# EAGLE design Tsop Receiver (EAGLE 7.6.0)
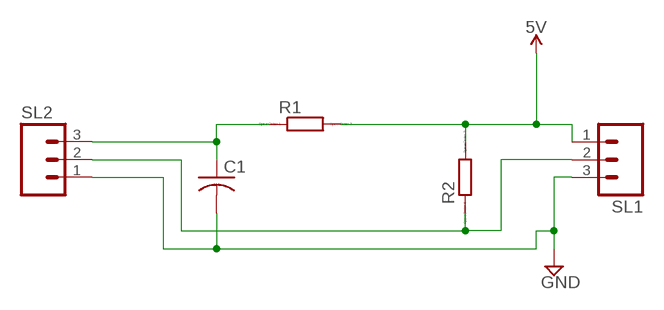
[diagram p0: schematic, sheet 1]

## Parts
C1  C-US025-024X044  [C025-024X044]
R1  R0207/10  [0207/10]
R2  R0207/10  [0207/10]
SL1  M03  [03P]
SL2  M03  [03P]

## Nets
5V: R1.2 R2.2 SL1.1
GND: C1.2 SL1.3 SL2.1
N$1: C1.1 R1.1 SL2.3
N$3: R2.1 SL1.2 SL2.2

## Library data of the parts
C1 = rcl:C-US: CAPACITOR, American symbol
R1 R2 = eagle-ltspice:R: RESISTOR, European symbol; SPICEMODEL: NONE; SPICEPREFIX: R
SL1 SL2 = con-amp-quick:M03: AMP QUICK CONNECTOR; OC_FARNELL: unknown; OC_NEWARK: unknown

## Board
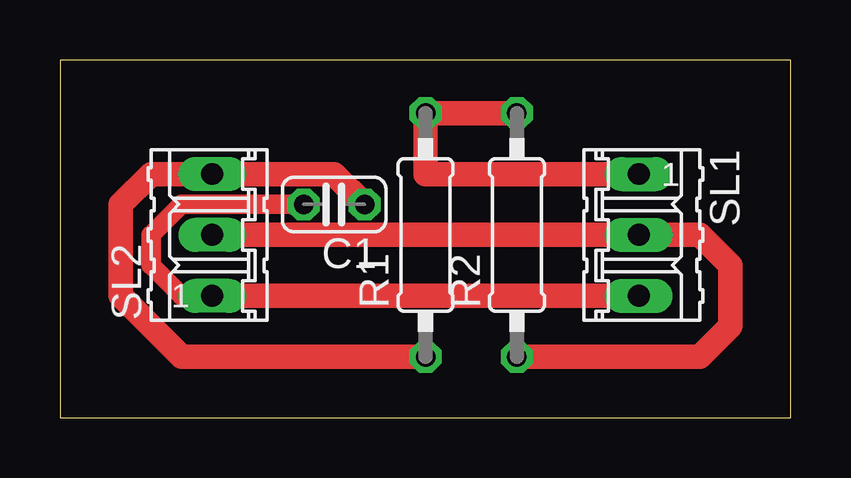
[diagram p1: board, top side]
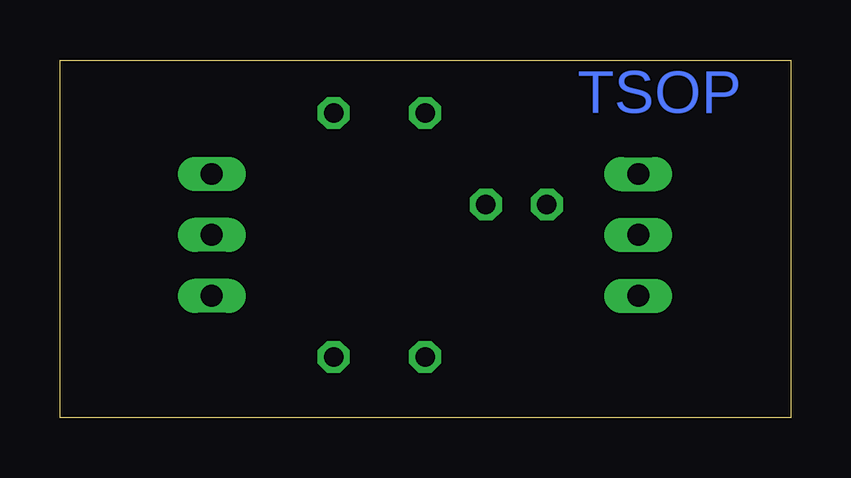
[diagram p2: board, bottom side, seen from below]

Size 30.46 x 14.91 mm. Coordinates in mm from the lower left corner, seen from the top.
Outline: 0,0 30.46,0 30.46,14.91 0,14.91 0,0
Copper layers (1*16): Top 0.035mm / dielectric 1.5mm / Bottom 0.035mm
Design rules "default": minimum track width 10mil, minimum drill 24mil, track to track 8mil, track to pad 8mil, pad to pad 8mil, via to via 8mil, smd to smd 8mil, copper to edge 40mil, drill to drill 8mil, minimum pad ring 10mil, minimum via ring 8mil, stop-mask expansion 4mil, vias tented up to drill 0mil, thermal gap 10mil

### Footprints (pad centres in the part's own frame; a part is rotated, then mirrored left to right if it is on the bottom)
C025-024X044 = drill 0.813 octagon: 1 -1.27,0; 2 1.27,0
0207/10 = drill 0.813 octagon: 1 -5.08,0; 2 5.08,0
03P = drill 0.914 long: 1 -2.54,0; 2 0,0; 3 2.54,0

### Placement (x,y rotation side)
C1  11.43,8.89 180 top
R1  15.24,7.62 90 top
R2  19.05,7.62 90 top
SL1  24.13,7.62 270 top
SL2  6.35,7.62 90 top

### Tracks (layer width: path | path; a pad name or v marks a point on that pad's centre or on a via)
5V
  Top 1.016: R2.2 R1.2 15.24,10.16 SL1.1
GND
  Top 0.813: C1.2 5.08,8.89 3.81,7.62 3.81,6.35 5.08,5.08 SL2.1
  Top 1.016: SL2.1 SL1.3
N$1
  Top 1.016: C1.1 11.43,10.16 SL2.3 3.81,10.16 2.54,8.89 2.54,5.08 5.08,2.54 R1.1
N$3
  Top 1.016: SL2.2 SL1.2 26.67,7.62 27.94,6.35 27.94,3.81 26.67,2.54 R2.1

### Text on the board
Bottom: TSOP